# EAGLE design LowduinoSMD_Take3 (EAGLE 7.2.0)
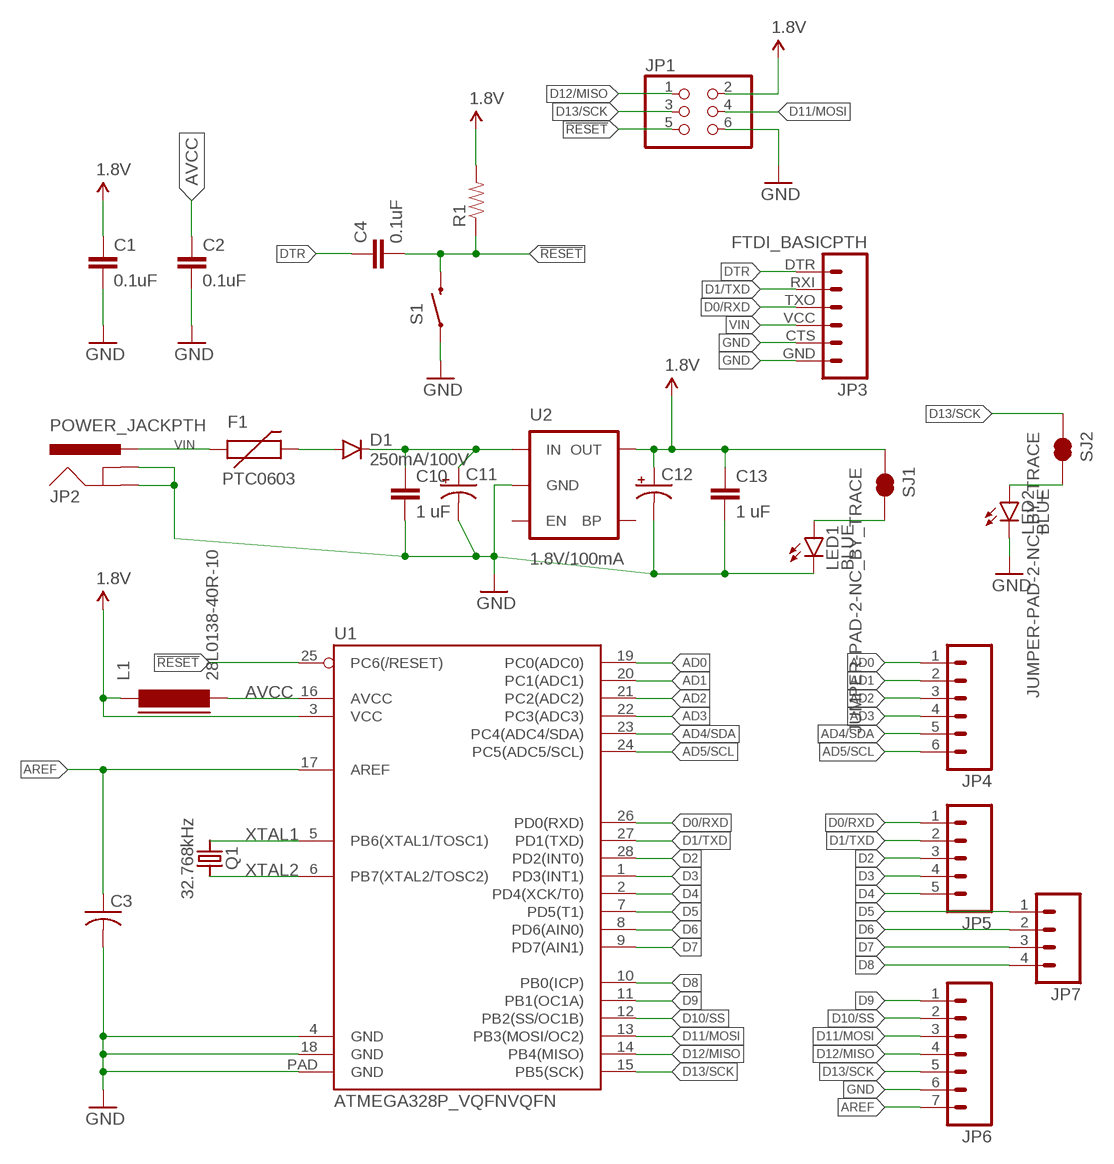
[diagram p0: schematic, sheet 1]

## Parts
C1  0.1uF  CAP0603-CAP  [0603-CAP]
C2  0.1uF  CAP0603-CAP  [0603-CAP]
C3  C-US01005  [C01005]
C4  0.1uF  CAP0402-CAP  [0402-CAP]
C10  1 uF  CAP0402-CAP  [0402-CAP]
C11  CAP_POLC  [PANASONIC_C]
C12  CAP_POLC  [PANASONIC_C]
C13  1 uF  CAP0402-CAP  [0402-CAP]
D1  250mA/100V  DIODEBAS16  [SOD-323]
F1  PTC0603  [0603]
JP1  PINHD-2X3  [2X03]
JP2  POWER_JACKPTH  [POWER_JACK_PTH]
JP3  FTDI_BASICPTH  [FTDI_BASIC]
JP4  M06SILK_FEMALE_PTH  [1X06]
JP5  M05PTH  [1X05]
JP6  M07  [1X07]
JP7  M04PTH  [1X04]
L1  28L0138-40R-10  FERRITE-0402  [FB402]
LED1  BLUE  LED-BLUE0603  [LED-0603]
LED2  BLUE  LED-BLUE0603  [LED-0603]
Q1  32.768kHz  FX12232.768KHZ  [2-SMD]
R1  RESISTOR0402  [0402-RES]
S1  SWITCH-MOMENTARY-2SMD  [TACTILE-SWITCH-SMD]
SJ1  JUMPER-PAD-2-NC_BY_TRACE  [PAD-JUMPER-2-NC_BY_TRACE_YES_SILK]
SJ2  JUMPER-PAD-2-NC_BY_TRACE  [PAD-JUMPER-2-NC_BY_TRACE_YES_SILK]
U1  ATMEGA328P_VQFNVQFN  [VQFN-28]
U2  1.8V/100mA  V_REG_SP62141.8V  [SC70]

## Nets
1.8V: C1.1 C12.+ C13.1 JP1.2 L1.1 R1.2 SJ1.1 U1.3(VCC) U2.5(OUT)
!RESET: C4.2 JP1.5 R1.1 S1.3 U1.25(PC6(/RESET))
AD0: JP4.1 U1.19(PC0(ADC0))
AD1: JP4.2 U1.20(PC1(ADC1))
AD2: JP4.3 U1.21(PC2(ADC2))
AD3: JP4.4 U1.22(PC3(ADC3))
AD4/SDA: JP4.5 U1.23(PC4(ADC4/SDA))
AD5/SCL: JP4.6 U1.24(PC5(ADC5/SCL))
AREF: C3.1 JP6.7 U1.17(AREF)
AVCC: C2.1 L1.2 U1.16(AVCC)
D0/RXD: JP3.TXO JP5.1 U1.26(PD0(RXD))
D1/TXD: JP3.RXI JP5.2 U1.27(PD1(TXD))
D2: JP5.3 U1.28(PD2(INT0))
D3: JP5.4 U1.1(PD3(INT1))
D4: JP5.5 U1.2(PD4(XCK/T0))
D5: JP7.1 U1.7(PD5(T1))
D6: JP7.2 U1.8(PD6(AIN0))
D7: JP7.3 U1.9(PD7(AIN1))
D8: JP7.4 U1.10(PB0(ICP))
D9: JP6.1 U1.11(PB1(OC1A))
D10/SS: JP6.2 U1.12(PB2(SS/OC1B))
D11/MOSI: JP1.4 JP6.3 U1.13(PB3(MOSI/OC2))
D12/MISO: JP1.1 JP6.4 U1.14(PB4(MISO))
D13/SCK: JP1.3 JP6.5 SJ2.1 U1.15(PB5(SCK))
DTR: C4.1 JP3.DTR
GND: C1.2 C2.2 C3.2 C10.2 C11.- C12.- C13.2 JP1.6 JP2.GND JP2.GNDBREAK JP3.CTS JP3.GND JP6.6 LED1.C LED2.C S1.1 U1.4(GND) U1.18(GND) U1.PAD(GND) U2.2(GND)
N$1: LED1.A SJ1.2
N$2: LED2.A SJ2.2
N$3: D1.A F1.2
N$7: C10.1 C11.+ D1.C U2.1(IN)
VIN: F1.1 JP2.PWR JP3.VCC
XTAL1: Q1.1 U1.5(PB6(XTAL1/TOSC1))
XTAL2: Q1.2 U1.6(PB7(XTAL2/TOSC2))
Unconnected: U2.3(EN) U2.4(BP)

## Library data of the parts
C1 C2 C4 C10 C13 = SparkFun-Capacitors:CAP: Capacitor Standard 0603 ceramic capacitor, and 0.1" leaded capacitor.
C3 = rcl:C-US: CAPACITOR, American symbol
C11 C12 = SparkFun-Capacitors:CAP_POL: Capacitor Polarized These are standard SMD and PTH capacitors. Normally 10uF, 47uF, and 100uF in electrolytic and tantalum varieties. Always verify the external diameter of the through hole cap, it varies with capacity, voltage, and manufacturer. The EIA devices should be standard.
D1 = SparkFun-DiscreteSemi:DIODE: Diode These are standard reverse protection diodes and small signal diodes. SMA package can handle up to about 1A. SOD-323 can handle about 200mA. What the SOD-323 package when ordering, there are some mfgs out there that are 5-pin packages.; PROD_ID: DIO-09646
F1 = SparkFun-PowerIC:PTC: Resettable Fuse PTC Resettable Fuse. Spark Fun Electronics SKU : COM-08357
JP1 = pinhead:PINHD-2X3: PIN HEADER
JP2 = SparkFun-Connectors:POWER_JACK: Power Jack This is the standard 5.5mm barrel jack for power. The PTH is the most common, proven, reliable, footprint. The Slot footprint only works if the mill layer is transmitted to the PCB fab house so be warned. Mating wall wart : TOL-00298 (and others); PROD_ID: CONN-08197
JP3 = SparkFun-Connectors:FTDI_BASIC: FTDI Basic header with labels
JP4 = SparkFun-Connectors:M06: Header 6 Standard 6-pin 0.1" header. Use with straight break away headers (SKU : PRT-00116), right angle break away headers (PRT-00553), swiss pins (PRT-00743), machine pins (PRT-00117), and female headers (PRT-00115). Molex polarized connector foot print use with SKU : PRT-08094 with associated crimp pins and housings. NOTES ON THE VARIANTS LOCK and LOCK_LONGPADS... This footprint was designed to help hold the alignment of a through-hole component (i.e. 6-pin header) while soldering it into place. You may notice that each hole has been shifted either up or down by 0.005 of an inch from it's more standard position (which is a perfectly straight line). This slight alteration caused the pins (the squares in the middle) to touch the edges of the holes. Because they are alternating, it causes a "brace" to hold the component in place. 0.005 has proven to be the perfect amount of "off-center" position when using our standard breakaway headers. Although looks a little odd when you look at the bare footprint, once you have a header in there, the alteration is very hard to notice. Also,if you push a header all the way into place, it is covered up entirely on the bottom side. This idea of altering the position of holes to aid alignment will be further integrated into the Sparkfun Library for other footprints. It can help hold any component with 3 or more connection pins.; PROD_ID: CONN-08437
JP5 = SparkFun-Connectors:M05: Header 5 Standard 5-pin 0.1" header. Use with straight break away headers (SKU : PRT-00116), right angle break away headers (PRT-00553), swiss pins (PRT-00743), machine pins (PRT-00117), and female headers (PRT-00115). Molex polarized connector foot print use with SKU : PRT-08230 with associated crimp pins and housings.
JP6 = SparkFun-Connectors:M07: Header 7 Standard 7-pin 0.1" header. Use with straight break away headers (SKU : PRT-00116), right angle break away headers (PRT-00553), swiss pins (PRT-00743), machine pins (PRT-00117), and female headers (PRT-00115). NOTES ON THE VARIANTS LOCK and LOCK_LONGPADS... This footprint was designed to help hold the alignment of a through-hole component (i.e. 7-pin header) while soldering it into place. You may notice that each hole has been shifted either up or down by 0.005 of an inch from it's more standard position (which is usually a perfectly straight line). This slight alteration caused the pins (the squares in the middle) to touch the edges of the holes. Because they are alternating, it causes a "brace" to hold the header in place. 0.005 has proven to be the perfect amount of "off-center" position when using our standard breakaway headers. Although looks a little odd when you look at the bare footprint, once you have a header in there, the alteration is very hard to notice. Also, if you push a header all the way into place, it is covered up entirely on the bottom side. This idea of altering the position of holes to aid alignment will be further integrated into the Sparkfun Library for other footprints. It can help hold any component with 3 or more connection pins.
JP7 = SparkFun-Connectors:M04: Header 4 Standard 4-pin 0.1" header. Use with straight break away headers (SKU : PRT-00116), right angle break away headers (PRT-00553), swiss pins (PRT-00743), machine pins (PRT-00117), and female headers (PRT-00115). Molex polarized connector foot print use with SKU : PRT-08231 with associated crimp pins and housings. 1MM SMD Version SKU: PRT-10208
L1 = dp_devices:FERRITE: Ferrite bead in various packages
LED1 LED2 = SparkFun-LED:LED-BLUE: Blue LEDs for production use Various blue LEDs stocked by SparkFun production 0603 - DIO-08575 Rebel - DIO-09553 1206 - DIO-09911; PROD_ID: DIO-08575
Q1 = fx122:FX122: FX122 - SMD 2.0 x 1.2 Tuning Fork Crystal Technical Specifications: Frequency: 32.768 kHz Frequency Tolerance @ 25ºC: ±20 PPM Frequency Stability Temperature Coefficient: -0.04 PPM / (ΔºC)^2 0.6mm Height Long Term Stability http://www.foxonline.com/pdfs/FX122.pdf; DIGIKEY: 631-1261-1-ND
R1 = SparkFun-Resistors:RESISTOR: Resistor Basic schematic elements and footprints for 0603, 1206, and PTH resistors.
S1 = SparkFun-Electromechanical:SWITCH-MOMENTARY-2: Various NO switches- pushbuttons, reed, etc; PROD_ID: SWCH-08247
SJ1 SJ2 = SparkFun-Passives:JUMPER-PAD-2-NC_BY_TRACE
U1 = SparkFun-DigitalIC:ATMEGA328P_VQFN
U2 = SparkFun-PowerIC:V_REG_SP6214; PROD_ID: VREG-08428

## Board
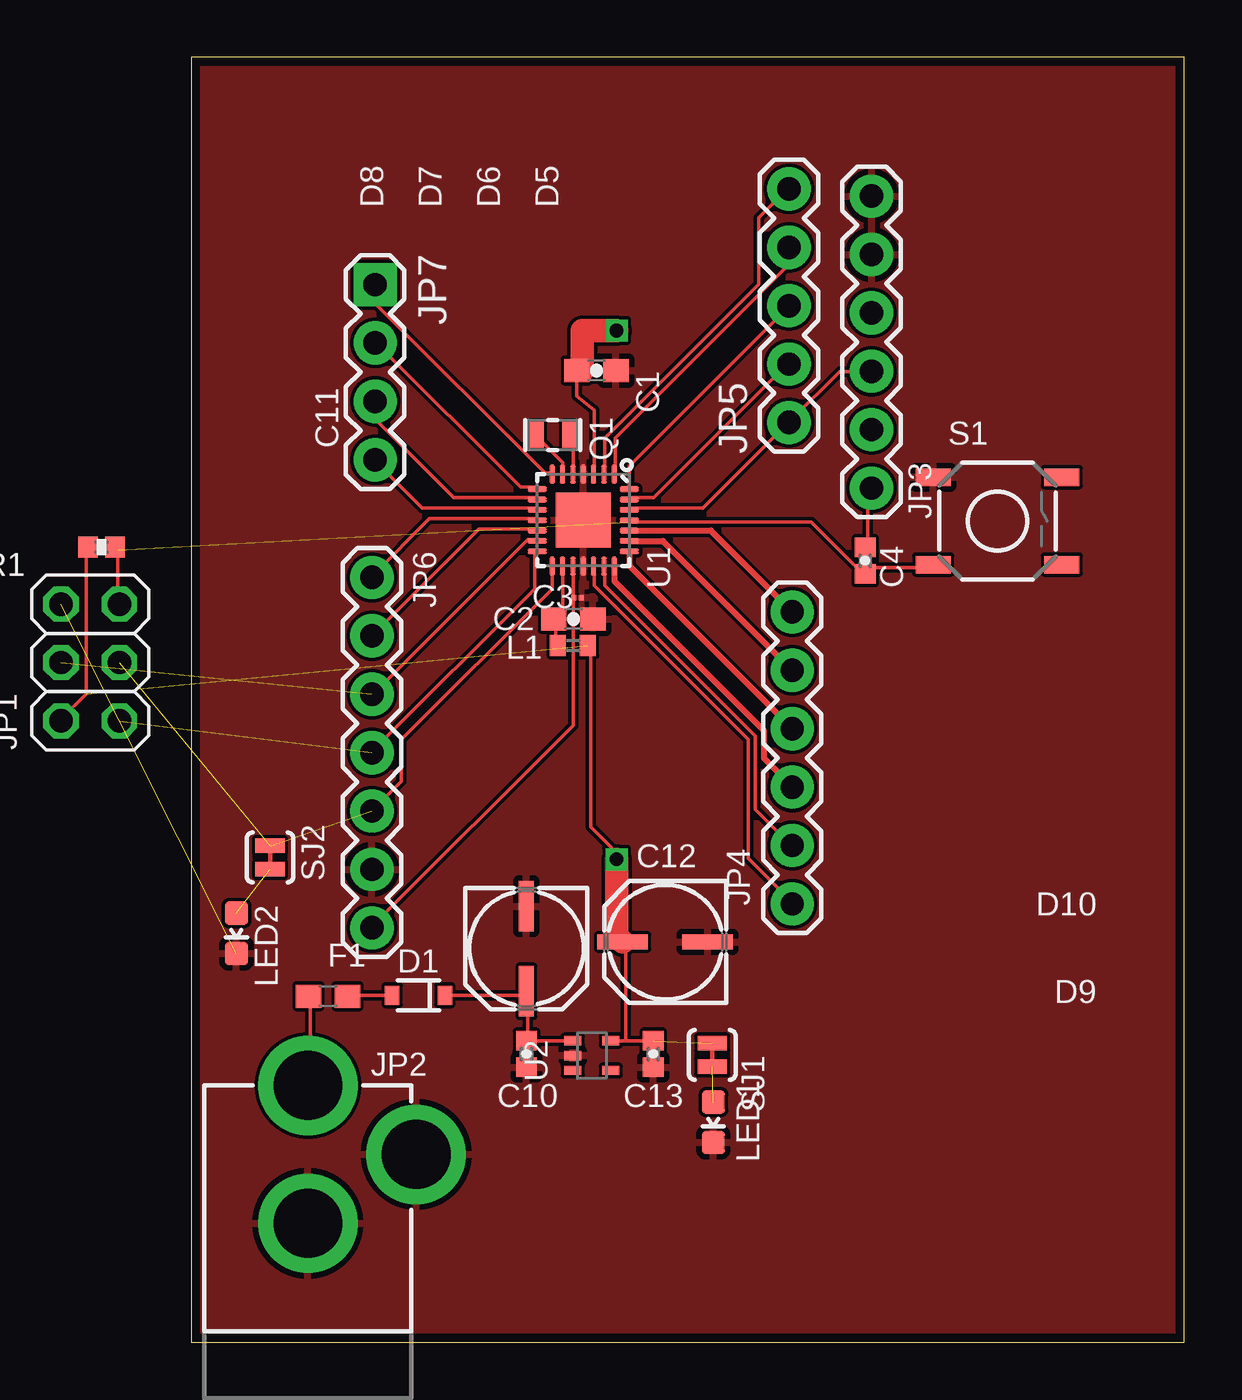
[diagram p1: board, top side]
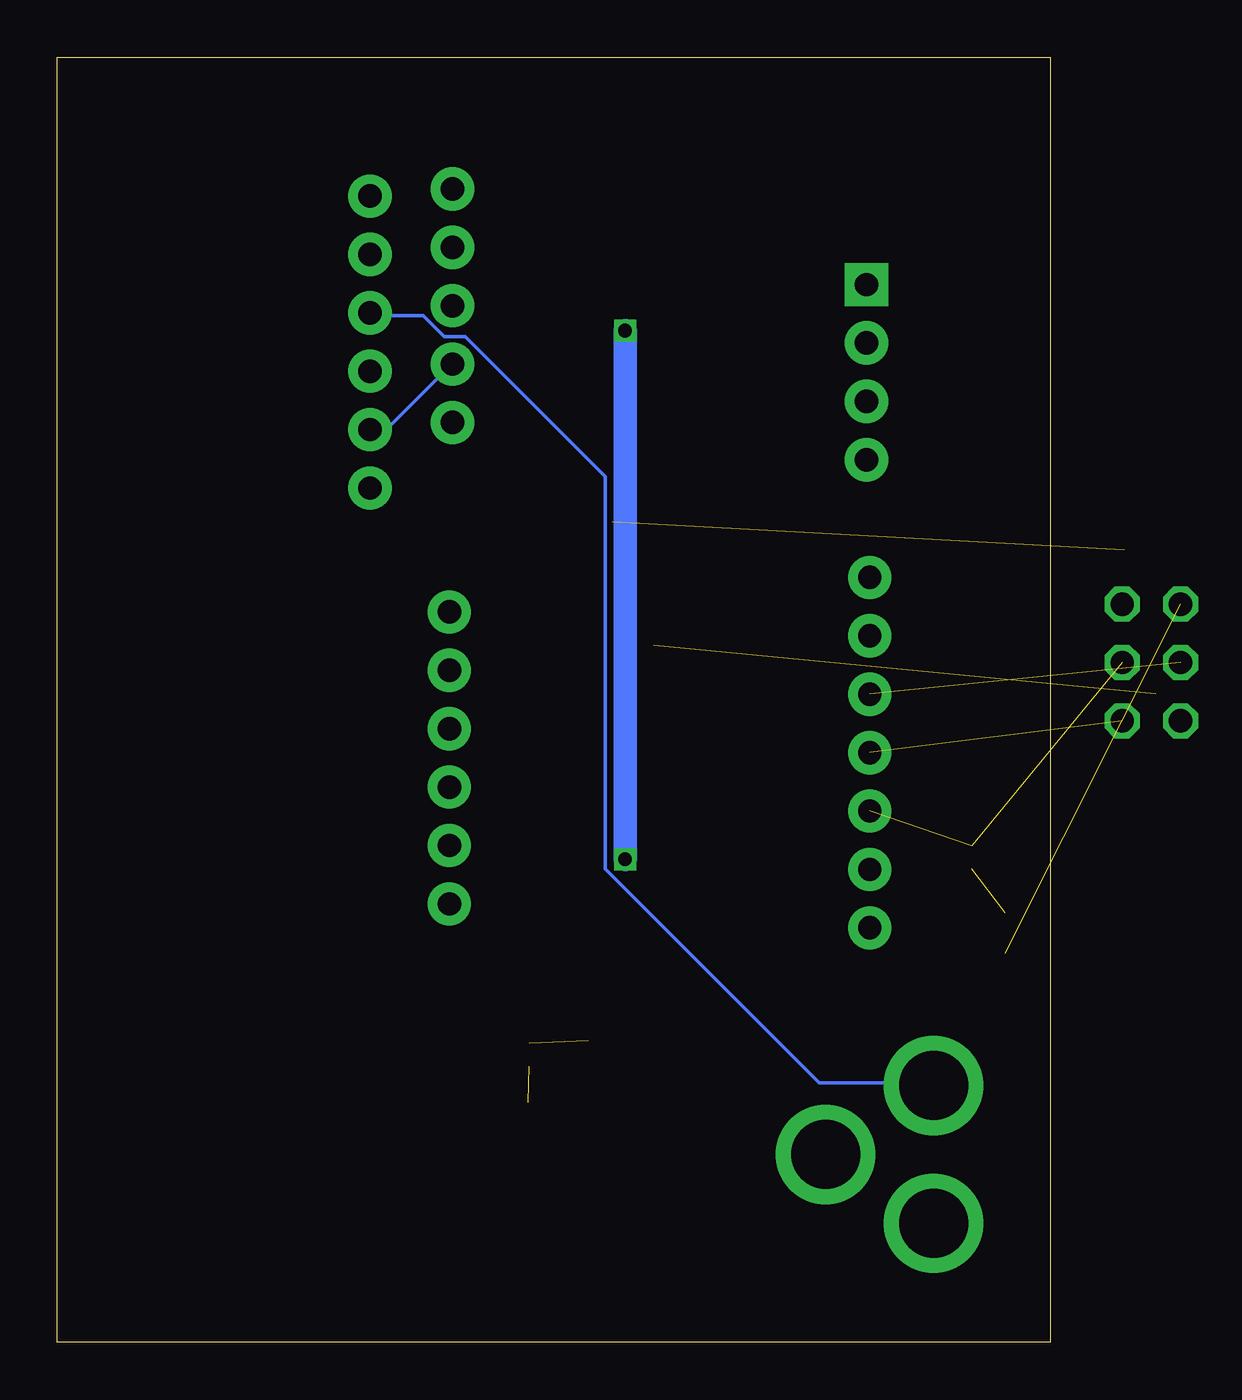
[diagram p2: board, bottom side, seen from below]

Size 43.18 x 55.88 mm. Coordinates in mm from the lower left corner, seen from the top.
Outline: 43.18,55.88 0,55.88 0,0 43.18,0 43.18,55.88
Copper layers (1*16): Top 0.0356mm / dielectric 1.5011mm / Bottom 0.0356mm
Design rules "oshpark-2layer *": minimum track width 6mil, minimum drill 13mil, track to track 6mil, track to pad 6mil, pad to pad 6mil, via to via 6mil, smd to smd 6mil, copper to edge 15mil, drill to drill 6mil, minimum pad ring 7mil, minimum via ring 7mil, stop-mask expansion 4mil, vias tented up to drill 0mil, thermal gap 10mil

### Footprints (pad centres in the part's own frame; a part is rotated, then mirrored left to right if it is on the bottom)
0603-CAP = smd 1.1 x 1: 1 -0.85,0; 2 0.85,0
C01005 = smd 0.2 x 0.25: 1 -0.163,0; 2 0.163,0
0402-CAP = smd 0.85 x 0.9: 1 -0.58,0; 2 0.58,0
PANASONIC_C = smd 2.2 x 0.65: + 1.9,-0.2; - -1.8,-0.2
SOD-323 = smd 0.63 x 0.83: A 1.15,0; C -1.15,0
0603 = smd 1.1 x 1: 1 -0.85,0; 2 0.85,0
2X03 = drill 1.016 octagon: 1 -2.54,-1.27; 2 -2.54,1.27; 3 0,-1.27; 4 0,1.27; 5 2.54,-1.27; 6 2.54,1.27
POWER_JACK_PTH = drill 2.997 pad 4.318: GND 0,7.7; GNDBREAK 4.7,10.7; PWR 0,13.7
FTDI_BASIC = drill 1.016 pad 1.88: CTS 10.16,0; DTR 0,0; GND 12.7,0; RXI 2.54,0; TXO 5.08,0; VCC 7.62,0
1X06 = drill 1.016 pad 1.88: 1 0,0; 2 2.54,0; 3 5.08,0; 4 7.62,0; 5 10.16,0; 6 12.7,0
1X05 = drill 1.016 pad 1.88: 1 0,0; 2 2.54,0; 3 5.08,0; 4 7.62,0; 5 10.16,0
1X07 = drill 1.016 pad 1.88: 1 0,0; 2 2.54,0; 3 5.08,0; 4 7.62,0; 5 10.16,0; 6 12.7,0; 7 15.24,0
1X04 = drill 1.016 pad 1.88 square: 1 0,0 | drill 1.016 pad 1.88: 2 2.54,0; 3 5.08,0; 4 7.62,0
FB402 = smd 0.7 x 0.9: 1 -0.65,0; 2 0.65,0
LED-0603 = smd 1 x 1: A 0,-0.877; C 0,0.877
2-SMD = smd 0.6 x 1.1: 1 -0.7,0; 2 0.7,0
0402-RES = smd 0.85 x 0.9: 1 -0.58,0; 2 0.58,0
TACTILE-SWITCH-SMD = smd 1.524 x 0.762: 1 -2.794,1.905; 2 2.794,1.905; 3 -2.794,-1.905; 4 2.794,-1.905
PAD-JUMPER-2-NC_BY_TRACE_YES_SILK = smd 0.635 x 1.27: 1 -0.508,0; 2 0.508,0
VQFN-28 = smd 0.82 x 0.24: 1 -2,1.35; 2 -2,0.9; 3 -2,0.45; 4 -2,0; 5 -2,-0.45; 6 -2,-0.9; 7 -2,-1.35; 15 2,-1.35; 16 2,-0.9; 17 2,-0.45; 18 2,0; 19 2,0.45; 20 2,0.9; 21 2,1.35 | smd 0.24 x 0.82: 8 -1.35,-2; 9 -0.9,-2; 10 -0.45,-2; 11 0,-2; 12 0.45,-2; 13 0.9,-2; 14 1.35,-2; 22 1.35,2; 23 0.9,2; 24 0.45,2; 25 0,2; 26 -0.45,2; 27 -0.9,2; 28 -1.35,2 | smd 2.4 x 2.4: PAD 0,0
SC70 = smd 0.4 x 0.75: 1 -0.65,-0.825; 2 0,-0.825; 3 0.65,-0.825; 4 0.65,0.825; 5 -0.65,0.825

### Placement (x,y rotation side)
C1  17.62,42.26 0 top
C2  16.62,31.46 0 top
C3  16.8,32.38 0 top
C4  29.31,33.99 270 top
C10  14.58,12.53 270 top
C11  14.78,17.16 270 top
C12  20.66,17.2 180 top
C13  20.09,12.53 270 top
D1  9.88,15.09 180 top
F1  5.95,15.04 0 top
JP1  -4.39,29.56 90 top  (outside the outline)
JP2  5.08,-2.54 0 top
JP3  29.59,37.15 90 top
JP4  26.14,19.06 90 top
JP5  26,40 90 top
JP6  7.86,33.26 270 top
JP7  8,46 270 top
L1  16.6,30.3 180 top
LED1  22.71,9.56 180 top
LED2  1.97,17.78 180 top
Q1  15.73,39.46 180 top
R1  -3.9,34.58 180 top  (outside the outline)
S1  35.06,35.72 0 top
SJ1  22.66,12.49 270 top
SJ2  3.43,21.08 270 top
U1  17.05,35.75 270 top
U2  17.42,12.46 270 top

### Tracks (layer width: path | path; a pad name or v marks a point on that pad's centre or on a via)
1.8V  (via drill 0.6)  (2 unrouted)
  Top 0.152: R1.2 -4.57,34.44 -4.57,28.19 -5.64,27.13 JP1.2 | 18.9,13.11 19.96,13.11 C13.1 | 18.9,13.11 18.29,13.11 U2.5 | U1.3 17.53,37.8 17.53,40.54 16.78,41.16 C1.1 | L1.1 17.37,30.18 17.37,22.4 18.29,21.49 v18.5,21 | 18.9,13.11 18.9,16.92 C12.+
  Top 1.016: C12.+ 18.5,17.66 v18.5,21 | v18.5,44 17,44 17,42.26 C1.1
  Bottom 1.016: v18.5,21 v18.5,44
!RESET  (1 unrouted)
  Top 0.152: R1.1 -3.2,34.44 -3.2,32.16 JP1.5 | U1.25 19.05,35.66 26.98,35.66 29.26,33.38 C4.2 29.41,33.53 29.57,33.68 32.16,33.68 S1.3
AD0
  Top 0.152: U1.19 17.53,33.68 17.53,32.92 24.23,26.21 24.23,21.03 26.06,19.2 JP4.1
AD1
  Top 0.152: U1.20 17.98,33.68 17.98,32.92 24.54,26.36 24.54,23.16 26.06,21.64 JP4.2
AD2
  Top 0.254: U1.21 18.4,33.1 24.9,26.6 24.9,25.4 26.14,24.16 JP4.3
AD3
  Top 0.254: U1.22 19.05,33.77 JP4.4
AD4/SDA
  Top 0.254: U1.23 20.51,34.85 JP4.5
AD5/SCL
  Top 0.254: U1.24 22.6,35.3 JP4.6
AREF
  Top 0.152: U1.17 16.61,33.68 16.61,32.46 C3.1 16.61,32.31 16.61,26.82 7.92,18.14 JP6.7
AVCC
  Top 0.152: U1.16 16.15,33.68 16.15,31.85 15.85,31.55 C2.1 15.85,31.39 15.85,30.33 L1.2
D0/RXD
  Top 0.152: U1.26 19.05,36.27 22.25,36.27 25.91,39.93 JP5.1 26.06,40.08 28.19,42.22 29.57,42.22 JP3.TXO
D1/TXD
  Top 0.152: U1.27 19.05,36.73 20.12,36.73 25.91,42.52 JP5.2
  Bottom 0.152: JP3.RXI 29.57,39.78 28.8,39.78 26.06,42.52 JP5.2
D2
  Top 0.152: U1.28 19.05,38.1 25.91,44.96 JP5.3
D3
  Top 0.152: U1.1 18.44,37.8 18.44,39.32 25.91,46.79 25.91,47.55 JP5.4
D4
  Top 0.152: U1.2 17.98,37.8 17.98,39.32 24.69,46.02 24.69,48.92 25.91,50.14 JP5.5
D5
  Top 0.152: U1.7 15.7,37.8 15.39,37.8 8.08,45.11 8.08,45.87 JP7.1
D6
  Top 0.152: U1.8 14.94,37.19 14.33,37.19 8.08,43.43 JP7.2
D7
  Top 0.152: U1.9 14.94,36.73 11.43,36.73 8.08,40.08 8.08,40.84 JP7.3
D8
  Top 0.152: U1.10 14.94,36.27 10.06,36.27 8.08,38.25 JP7.4
D9
  Top 0.152: U1.11 14.94,35.81 10.36,35.81 7.92,33.38 JP6.1
D10/SS
  Top 0.152: JP6.2 12.5,35.36 14.94,35.36 U1.12
D11/MOSI  (1 unrouted)
  Top 0.152: U1.13 14.94,34.9 14.63,34.9 7.92,28.19 JP6.3
D12/MISO  (1 unrouted)
  Top 0.152: U1.14 14.94,34.29 14.94,32.77 7.92,25.76 JP6.4
D13/SCK  (2 unrouted)
  Top 0.152: JP6.5 9.14,24.38 9.14,26.21 15.7,32.77 15.7,33.68 U1.15
DTR
  Top 0.152: C4.1 29.41,34.59 29.41,36.88 29.57,37.03 JP3.DTR
GND  (1 unrouted)
  pour Top: 43.18,55.88 0,55.88 0,0 43.18,0
N$1  (1 unrouted)
N$2  (1 unrouted)
N$3
  Top 0.152: D1.A 8.69,15.09 6.86,15.09 F1.2
N$7
  Top 0.152: U2.1 16.46,13.11 14.63,13.11 C10.1 14.63,13.26 14.63,15.24 C11.+ 14.48,15.24 14.33,15.09 11.12,15.09 D1.C
VIN
  Top 0.152: F1.1 5.18,14.94 5.18,11.28 JP2.PWR
  Bottom 0.152: JP3.VCC 29.57,44.65 27.28,44.65 26.36,43.74 25.45,43.74 19.36,37.64 19.36,20.57 10.06,11.28 5.18,11.28 JP2.PWR
XTAL1
  Top 0.152: U1.5 16.61,37.8 16.61,39.17 16.46,39.32 Q1.1
XTAL2
  Top 0.152: U1.6 16.15,37.8 16.15,38.25 15.09,39.32 Q1.2

### Text on the board
tNames: D8 | D7 | D6 | D5 | D10 | D9